# EAGLE design I2C Mini Line Sensor (EAGLE 6.4)
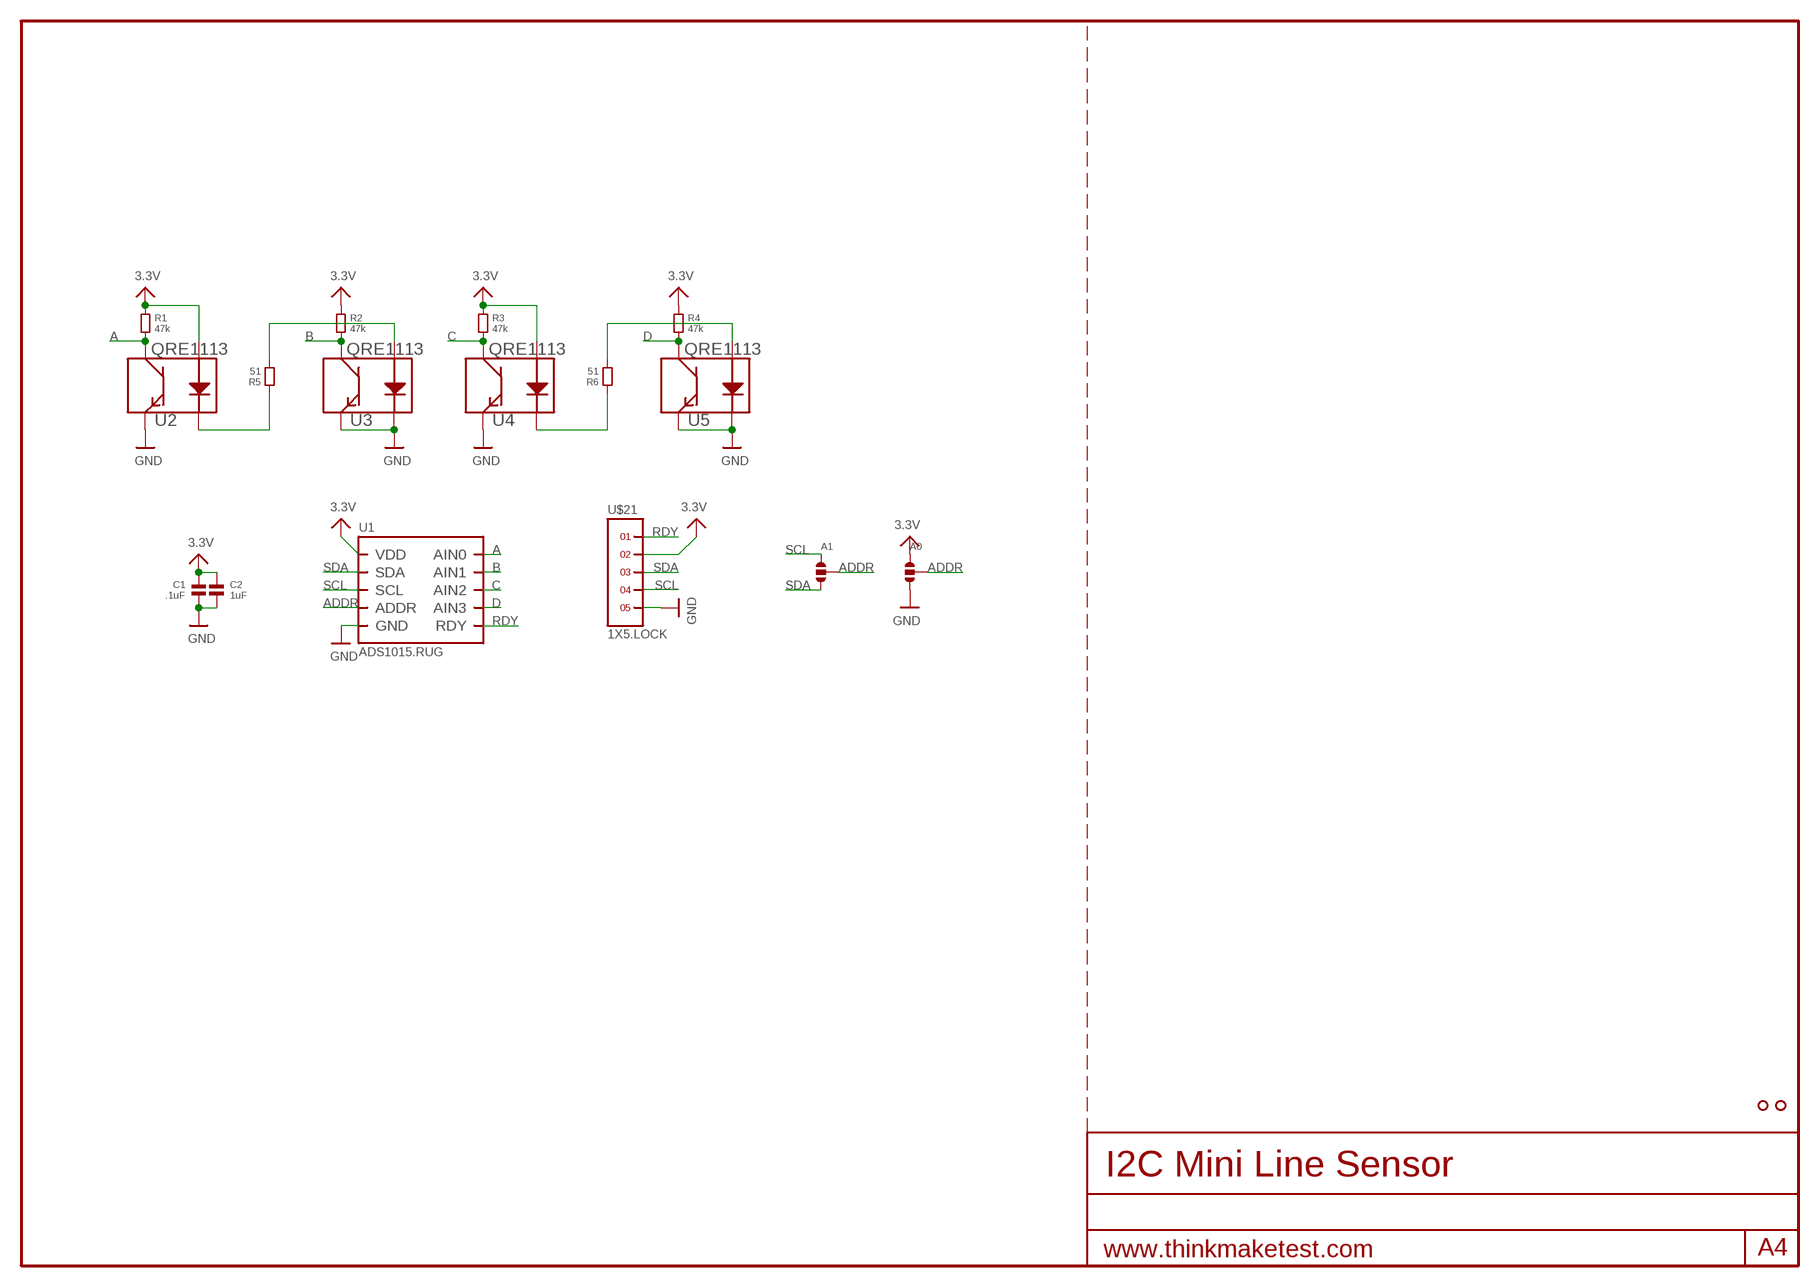
[diagram p0: schematic, sheet 1]

## Parts
A0  SOLDERJUMPER.3.MED  [3.MED]
A1  SOLDERJUMPER.3.MED  [3.MED]
C1  .1uF  CAPACITOR.0603  [0603]
C2  1uF  CAPACITOR.0603  [0603]
R1  47k  RESISTOR.0603  [0603]
R2  47k  RESISTOR.0603  [0603]
R3  47k  RESISTOR.0603  [0603]
R4  47k  RESISTOR.0603  [0603]
R5  51  RESISTOR.0603  [0603]
R6  51  RESISTOR.0603  [0603]
U1  ADS1015.RUG  [RUG.10]
U2  QRE1113  [QRE1113]
U3  QRE1113  [QRE1113]
U4  QRE1113  [QRE1113]
U5  QRE1113  [QRE1113]
U$3  HOLE.2MM  [2MM]
U$18  HOLE.2MM  [2MM]
U$21  1X5.LOCK  [1X5.LOCK]

## Nets
3.3V: A0.1 C1.1 C2.1 R1.1 R2.1 R3.1 R4.1 U1.8(VDD) U2.1(A) U4.1(A) U$21.2
A: R1.2 U1.4(AIN0) U2.3(C)
ADDR: A0.2 A1.2 U1.1(ADDR)
B: R2.2 U1.5(AIN1) U3.3(C)
C: R3.2 U1.6(AIN2) U4.3(C)
D: R4.2 U1.7(AIN3) U5.3(C)
GND: A0.3 C1.2 C2.2 U1.3(GND) U2.4(E) U3.2(K) U3.4(E) U4.4(E) U5.2(K) U5.4(E) U$21.5
N$1: R5.1 U2.2(K)
N$2: R5.2 U3.1(A)
N$3: R6.1 U4.2(K)
N$4: R6.2 U5.1(A)
RDY: U1.2(RDY) U$21.1
SCL: A1.1 U1.10(SCL) U$21.4
SDA: A1.3 U1.9(SDA) U$21.3

## Library data of the parts
A0 A1 = solderjumper:SOLDERJUMPER.3
C1 C2 = standardparts:CAPACITOR
R1-R6 = standardparts:RESISTOR
U1 = packages(ti):ADS1015
U2-U5 = SparkFun-Sensors:QRE1113: Reflective object sensor
U$3 U$18 = screw_holes:HOLE
U$21 = headers(.1in):1X5

## Board
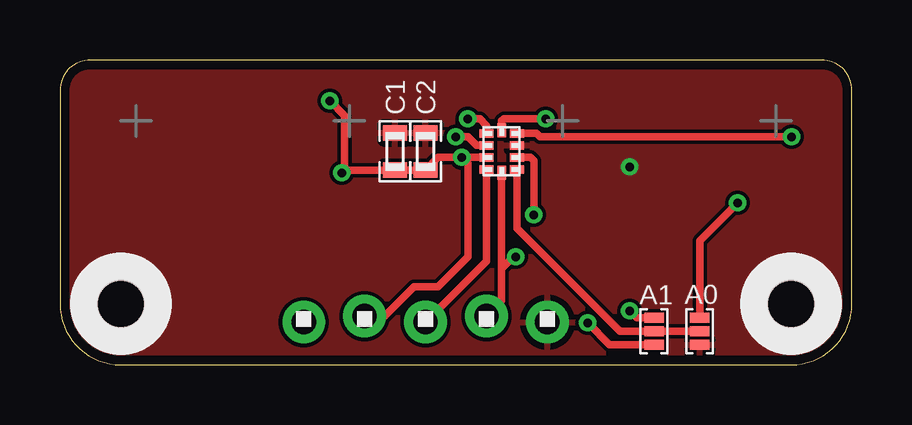
[diagram p1: board, top side]
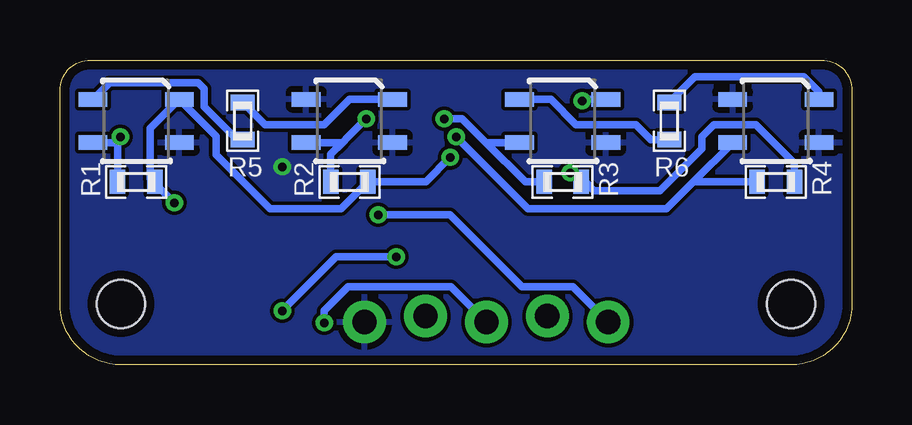
[diagram p2: board, bottom side, seen from below]

Size 33.02 x 12.7 mm. Coordinates in mm from the lower left corner, seen from the top.
Outline: 0,11.43 0,2.54 arc90 2.54,0 30.48,0 arc90 33.02,2.54 33.02,11.43 arc90 31.75,12.7 1.27,12.7 arc90 0,11.43
Copper layers (1*16): Top 0.0356mm / dielectric 1.5011mm / Bottom 0.0356mm
Design rules "OSHPark": minimum track width 6mil, minimum drill 13mil, track to track 6mil, track to pad 6mil, pad to pad 6mil, via to via 6mil, smd to smd 6mil, copper to edge 15mil, drill to drill 6mil, minimum pad ring 7mil, minimum via ring 7mil, stop-mask expansion 4mil, vias tented up to drill 16mil, thermal gap 10mil

### Footprints (pad centres in the part's own frame; a part is rotated, then mirrored left to right if it is on the bottom)
3.MED = smd 0.406 x 0.813: 1 -0.559,0; 2 0,0; 3 0.559,0
0603 = smd 0.65 x 1: 1 -0.775,0; 2 0.775,0
RUG.10 = smd 0.58 x 0.35: 1 -0.635,0.75; 2 -0.635,0.25; 3 -0.635,-0.25; 4 -0.635,-0.75; 6 0.635,-0.75; 7 0.635,-0.25; 8 0.635,0.25; 9 0.635,0.75 | smd 0.35 x 0.58: 5 0,-0.885; 10 0,0.885
QRE1113 = smd 1.2 x 0.6: 1 -1.8,-0.9; 2 1.8,-0.9; 3 1.8,0.9; 4 -1.8,0.9
2MM = hole 2: 0,0
1X5.LOCK = drill 1.016 pad 1.778: 1 0,-0.127; 2 2.54,0.127; 3 5.08,-0.127; 4 7.62,0.127; 5 10.16,-0.127

### Placement (x,y rotation side)
A0  26.67,1.4 270 top
A1  24.77,1.4 270 top
C1  13.97,8.89 90 top
C2  15.24,8.89 90 top
R1  29.84,7.62 180 bottom
R2  20.95,7.62 180 bottom
R3  12.06,7.62 180 bottom
R4  3.17,7.62 180 bottom
R5  25.4,10.16 90 bottom
R6  7.62,10.16 90 bottom
U1  18.41,8.89 180 top
U2  29.84,10.16 180 bottom
U3  20.95,10.16 180 bottom
U4  12.06,10.16 180 bottom
U5  3.17,10.16 180 bottom
U$3  2.54,2.54 0 top
U$18  30.48,2.54 0 top
U$21  10.16,1.91 0 top

### Tracks (layer width: path | path; a pad name or v marks a point on that pad's centre or on a via)
3.3V  (via drill 0.36)
  Top 0.305: U1.8 v16.75,8.64 | 11.87,8.12 C1.1 C2.1 15.77,8.64 v16.75,8.64 | 11.87,8.12 v11.75,8 | 11.87,8.12 11.87,10.38 v11.25,11 | v16.75,8.64 17,8.39 17,4.5 15.75,3.25 14.75,3.25 13.53,2.03 U$21.2 | A0.1 26.67,5.17 v28.25,6.75
  Bottom 0.305: R4.1 2.4,8.4 4,10 5.75,10 6.25,9.5 6.25,9 8,7.25 10.75,7.25 11.12,7.62 R3.1 11.37,7.62 v11.75,8 | v11.25,11 11.19,11.06 U4.1 | R1.1 29.25,7.8 | 29.25,7.8 29.25,9.86 U2.1 26.5,9.52 26.5,8.75 24.25,6.5 21.3,6.5 R2.1 17.77,7.62 v16.75,8.64 | v28.25,6.75 29.25,7.75 29.25,7.8
A  (via drill 0.36)
  Top 0.305: U1.4 19.86,9.64 20,9.5 v30.5,9.5
  Bottom 0.305: U2.3 30.74,9.26 v30.5,9.5 30.62,9.38 R1.2
ADDR
  Top 0.305: U1.1 19.05,5.7 23.35,1.4 A1.2 A0.2
B  (via drill 0.36)
  Top 0.305: U1.5 18.41,10.16 18.5,10.25 v20.25,10.25
  Bottom 0.305: R2.2 21.73,8.77 21.24,9.26 | v20.25,10.25 21,9.5 21.24,9.26 | U3.3 21.24,9.26
C  (via drill 0.36)
  Top 0.305: U1.6 17.78,9.97 17.5,10.25 v17,10.25
  Bottom 0.305: v17,10.25 16.25,10.25 15.25,9.25 | 15.25,9.25 13.62,7.62 R3.2 | U4.3 15.25,9.25
D  (via drill 0.36)
  Top 0.305: U1.7 17.36,9.14 17,9.5 v16.5,9.5
  Bottom 0.305: v16.5,9.5 13.5,6.5 7.74,6.5 6.62,7.62 | 6.62,7.62 U5.3 | R4.2 6.62,7.62
GND  (via drill 0.36)
  other vias: 23.75,8.25
  pour Top (rank 6): 0,12.7 33.02,12.7 33.02,0 0,0
  pour Bottom: 0,12.7 33.02,12.7 33.02,0 0,0
N$1
  Bottom 0.305: U2.2 30.95,11.75 27.25,11.75 27,11.5 27,10.75 25.64,9.38 R5.1
N$2
  Bottom 0.305: R5.2 24.46,10 22,10 20.94,11.06 U3.1
N$3
  Bottom 0.305: R6.1 8.38,9.38 9,10 11.5,10 12.56,11.06 U4.2
N$4
  Bottom 0.305: R6.2 6.55,12 2,12 1.38,11.38 U5.1
RDY  (via drill 0.36)
  Top 0.305: U1.2 19.61,8.64 19.75,8.5 v19.75,6.25
  Bottom 0.305: v19.75,6.25 16.75,6.25 13.75,3.25 11.63,3.25 U$21.1
SCL  (via drill 0.36)
  Top 0.305: U1.10 18.41,4 | 18.41,4 18.41,2.67 U$21.4 | A1.1 24.04,1.96 v23.75,2.25 | v19,4.5 18.91,4.5 18.41,4
  Bottom 0.305: v23.75,2.25 21.5,4.5 v19,4.5
SDA  (via drill 0.36)
  Top 0.305: U1.9 17.78,4.32 U$21.3 | A1.3 22.91,0.84 v22,1.75
  Bottom 0.305: v22,1.75 22,2.25 21,3.25 16.71,3.25 U$21.3

### Text on the board
tDocu: 1 | 2 | 3 | 4 | I2C Mini Line Sensor
bDocu: Anomalous / Maker.com | Cruz / Monrreal II | 3.3v | SDA | SCL | GND | RDY